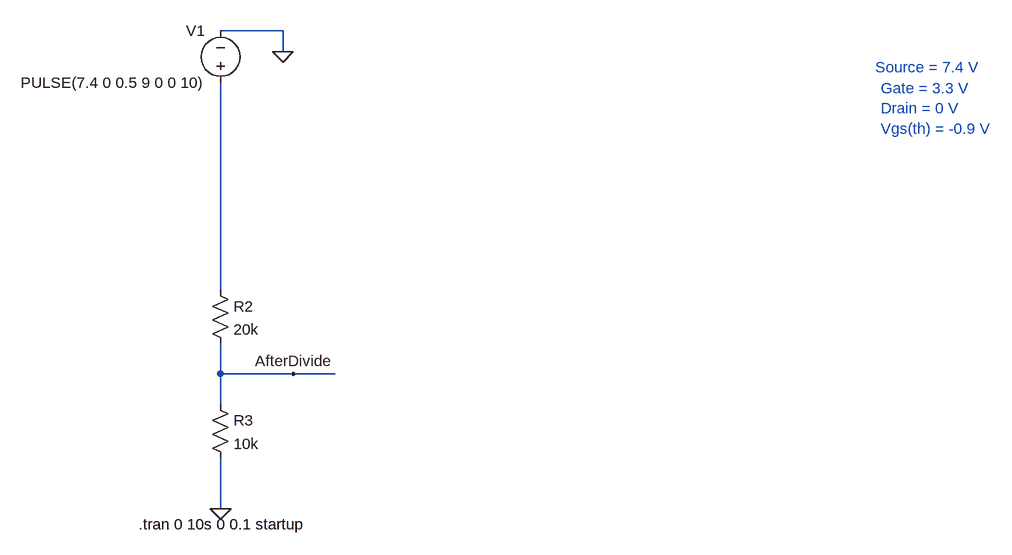
[diagram p0: schematic Draft2.asc]
Draft2.asc, the LTspice schematic file:
Version 4
SHEET 1 1416 808
WIRE 304 32 208 32
WIRE 304 64 304 32
WIRE 208 432 208 112
WIRE 208 560 208 512
WIRE 320 560 208 560
WIRE 384 560 320 560
WIRE 208 608 208 560
WIRE 208 768 208 688
FLAG 304 64 0
FLAG 208 768 0
FLAG 320 560 AfterDivide
SYMBOL voltage 208 128 R180
WINDOW 0 24 96 Left 2
WINDOW 3 24 16 Left 2
WINDOW 123 0 0 Left 0
WINDOW 39 0 0 Left 0
SYMATTR InstName V1
SYMATTR Value PULSE(7.4 0 0.5 9 0 0 10)
SYMBOL res 192 416 R0
SYMATTR InstName R2
SYMATTR Value 20k
SYMBOL res 192 592 R0
SYMATTR InstName R3
SYMATTR Value 10k
TEXT 82 792 Left 2 !.tran 0 10s 0 0.1 startup
TEXT 1216 88 Left 2 ;Source = 7.4 V
TEXT 1224 120 Left 2 ;Gate = 3.3 V\nDrain = 0 V\nVgs(th) = -0.9 V

The netlist it stands for:
* Draft2.asc
V1 N001 0 PULSE(7.4 0 0.5 9 0 0 10)
R2 N001 AfterDivide 20k
R3 AfterDivide 0 10k
.tran 0 10s 0 0.1 startup
* Source = 7.4 V
* Gate = 3.3 V
* Drain = 0 V
* Vgs(th) = -0.9 V
.backanno
.end